# EAGLE design STM32F4DiscoveryBreakoutBoard (EAGLE 9.2.2)
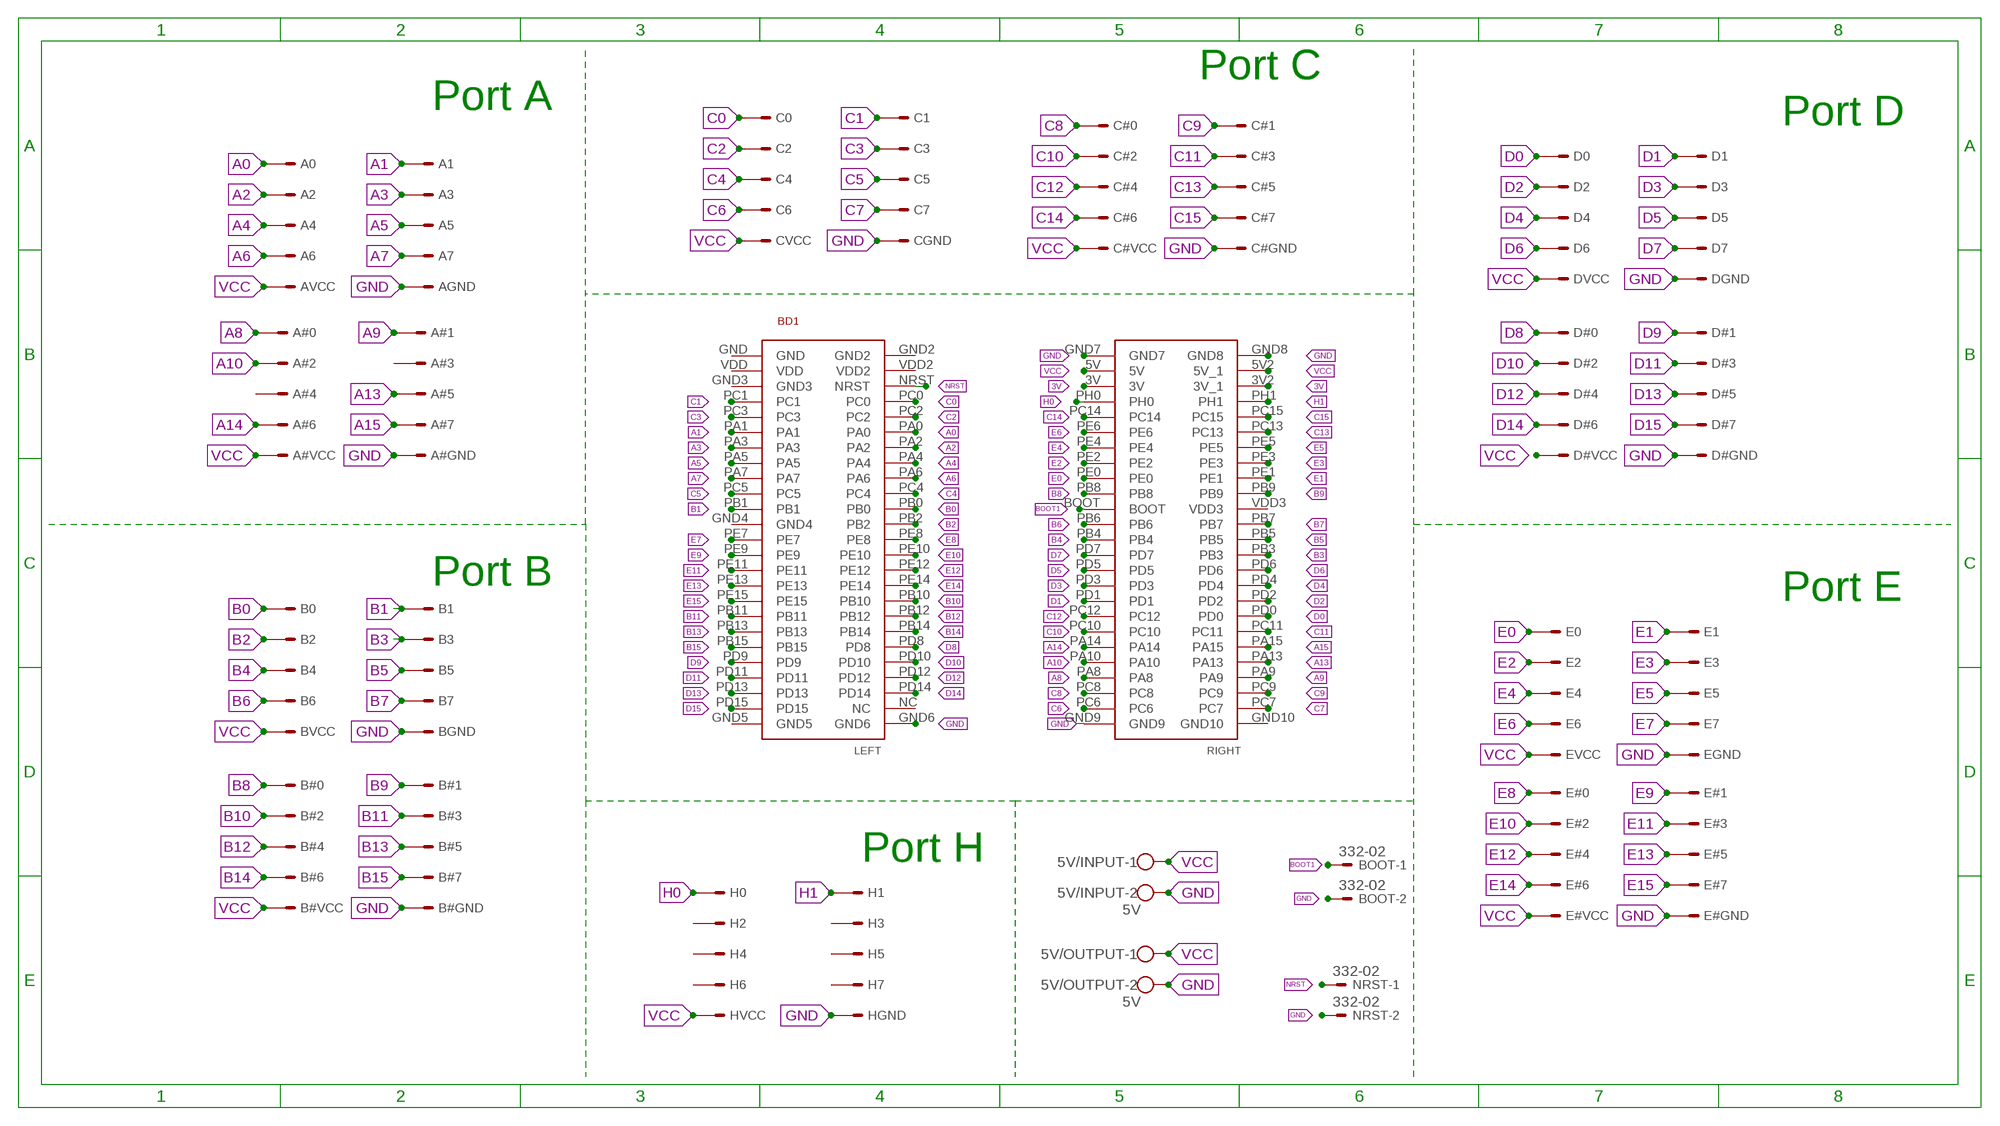
[diagram p0: schematic, sheet 1]

## Parts
5V/INPUT  5V  W237-102  [W237-102]
5V/OUTPUT  5V  W237-102  [W237-102]
A  FR1  [057-010-1]
A#  FR1  [057-010-1]
B  FR1  [057-010-1]
B#  FR1  [057-010-1]
BD1  STM32F4-DISCOVERY  [STM32F407VG]
BOOT  332-02  [332-02]
C  FR1  [057-010-1]
C#  FR1  [057-010-1]
D  FR1  [057-010-1]
D#  FR1  [057-010-1]
E  FR1  [057-010-1]
E#  FR1  [057-010-1]
H  FR1  [057-010-1]
NRST  332-02  [332-02]

## Nets
3V: BD1.3V BD1.3V2(3V_1)
A0: A.0 BD1.PA0
A1: A.1 BD1.PA1
A2: A.2 BD1.PA2
A3: A.3 BD1.PA3
A4: A.4 BD1.PA4
A5: A.5 BD1.PA5
A6: A.6 BD1.PA6
A7: A.7 BD1.PA7
A8: A#.0 BD1.PA8
A9: A#.1 BD1.PA9
A10: A#.2 BD1.PA10
A13: A#.5 BD1.PA13
A14: A#.6 BD1.PA14
A15: A#.7 BD1.PA15
B0: B.0 BD1.PB0
B1: B.1 BD1.PB1
B2: B.2 BD1.PB2
B3: B.3 BD1.PB3
B4: B.4 BD1.PB4
B5: B.5 BD1.PB5
B6: B.6 BD1.PB6
B7: B.7 BD1.PB7
B8: B#.0 BD1.PB8
B9: B#.1 BD1.PB9
B10: B#.2 BD1.PB10
B11: B#.3 BD1.PB11
B12: B#.4 BD1.PB12
B13: B#.5 BD1.PB13
B14: B#.6 BD1.PB14
B15: B#.7 BD1.PB15
BOOT1: BD1.BOOT BOOT.1
C0: BD1.PC0 C.0
C1: BD1.PC1 C.1
C2: BD1.PC2 C.2
C3: BD1.PC3 C.3
C4: BD1.PC4 C.4
C5: BD1.PC5 C.5
C6: BD1.PC6 C.6
C7: BD1.PC7 C.7
C8: BD1.PC8 C#.0
C9: BD1.PC9 C#.1
C10: BD1.PC10 C#.2
C11: BD1.PC11 C#.3
C12: BD1.PC12 C#.4
C13: BD1.PC13 C#.5
C14: BD1.PC14 C#.6
C15: BD1.PC15 C#.7
D0: BD1.PD0 D.0
D1: BD1.PD1 D.1
D2: BD1.PD2 D.2
D3: BD1.PD3 D.3
D4: BD1.PD4 D.4
D5: BD1.PD5 D.5
D6: BD1.PD6 D.6
D7: BD1.PD7 D.7
D8: BD1.PD8 D#.0
D9: BD1.PD9 D#.1
D10: BD1.PD10 D#.2
D11: BD1.PD11 D#.3
D12: BD1.PD12 D#.4
D13: BD1.PD13 D#.5
D14: BD1.PD14 D#.6
D15: BD1.PD15 D#.7
E0: BD1.PE0 E.0
E1: BD1.PE1 E.1
E2: BD1.PE2 E.2
E3: BD1.PE3 E.3
E4: BD1.PE4 E.4
E5: BD1.PE5 E.5
E6: BD1.PE6 E.6
E7: BD1.PE7 E.7
E8: BD1.PE8 E#.0
E9: BD1.PE9 E#.1
E10: BD1.PE10 E#.2
E11: BD1.PE11 E#.3
E12: BD1.PE12 E#.4
E13: BD1.PE13 E#.5
E14: BD1.PE14 E#.6
E15: BD1.PE15 E#.7
GND: 5V/INPUT.2 5V/OUTPUT.2 A#.GND A.GND B#.GND B.GND BD1.GND6 BD1.GND7 BD1.GND8 BD1.GND9 BOOT.2 C#.GND C.GND D#.GND D.GND E#.GND E.GND H.GND NRST.2
H0: BD1.PH0 H.0
H1: BD1.PH1 H.1
NRST: BD1.NRST NRST.1
VCC: 5V/INPUT.1 5V/OUTPUT.1 A#.VCC A.VCC B#.VCC B.VCC BD1.5V BD1.5V2(5V_1) C#.VCC C.VCC D#.VCC D.VCC E#.VCC E.VCC H.VCC
Unconnected: A#.3 A#.4 BD1.GND BD1.GND2 BD1.GND3 BD1.GND4 BD1.GND5 BD1.GND10 BD1.NC BD1.VDD BD1.VDD2 BD1.VDD3 H.2 H.3 H.4 H.5 H.6 H.7

## Notes on the sheet
- Port C
- Port A
- Port D
- Port B
- Port E
- Port H

## Library data of the parts
5V/INPUT 5V/OUTPUT = con-wago-500:W237-102: WAGO SCREW CLAMP; MPN: 237-102; OC_FARNELL: unknown; OC_NEWARK: 70K9898
A A# B B# C C# D D# E E# H = FRC (1):FR: CONNECTOR 10-pin series 057 contact pc board low profile headers; OC_FARNELL: unknown; OC_NEWARK: unknown
BD1 = STM32F4 DISCOVERY:STM32F4-DISCOVERY: STM32F4DISCOVERY STM32F407VG Create by Jairo Reyes Email: jairo.314@hotmail.com
BOOT NRST = con-garry:332-02: 2 Pin - 2mm Dual Row Source: www.mpe-connector.de / garry_shortform_2012.pdf

## Board
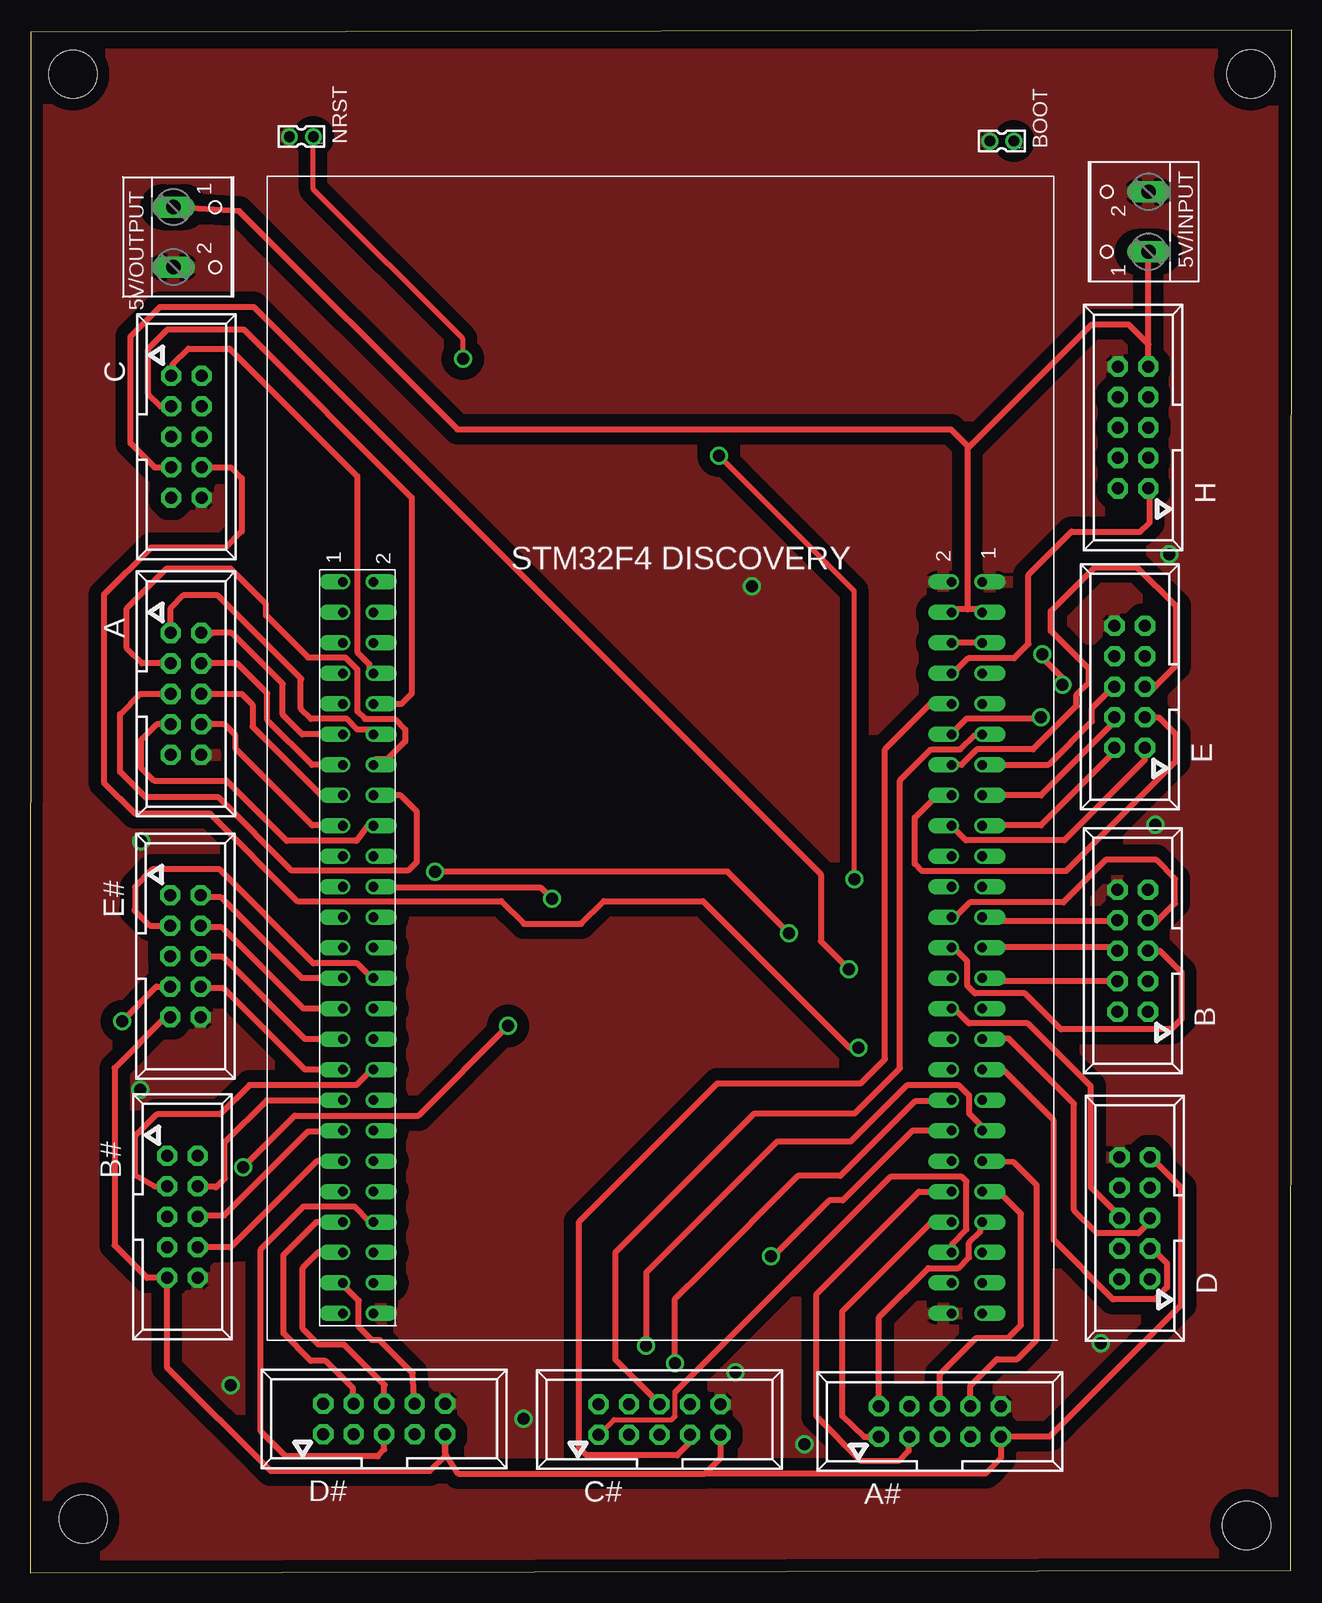
[diagram p1: board, top side]
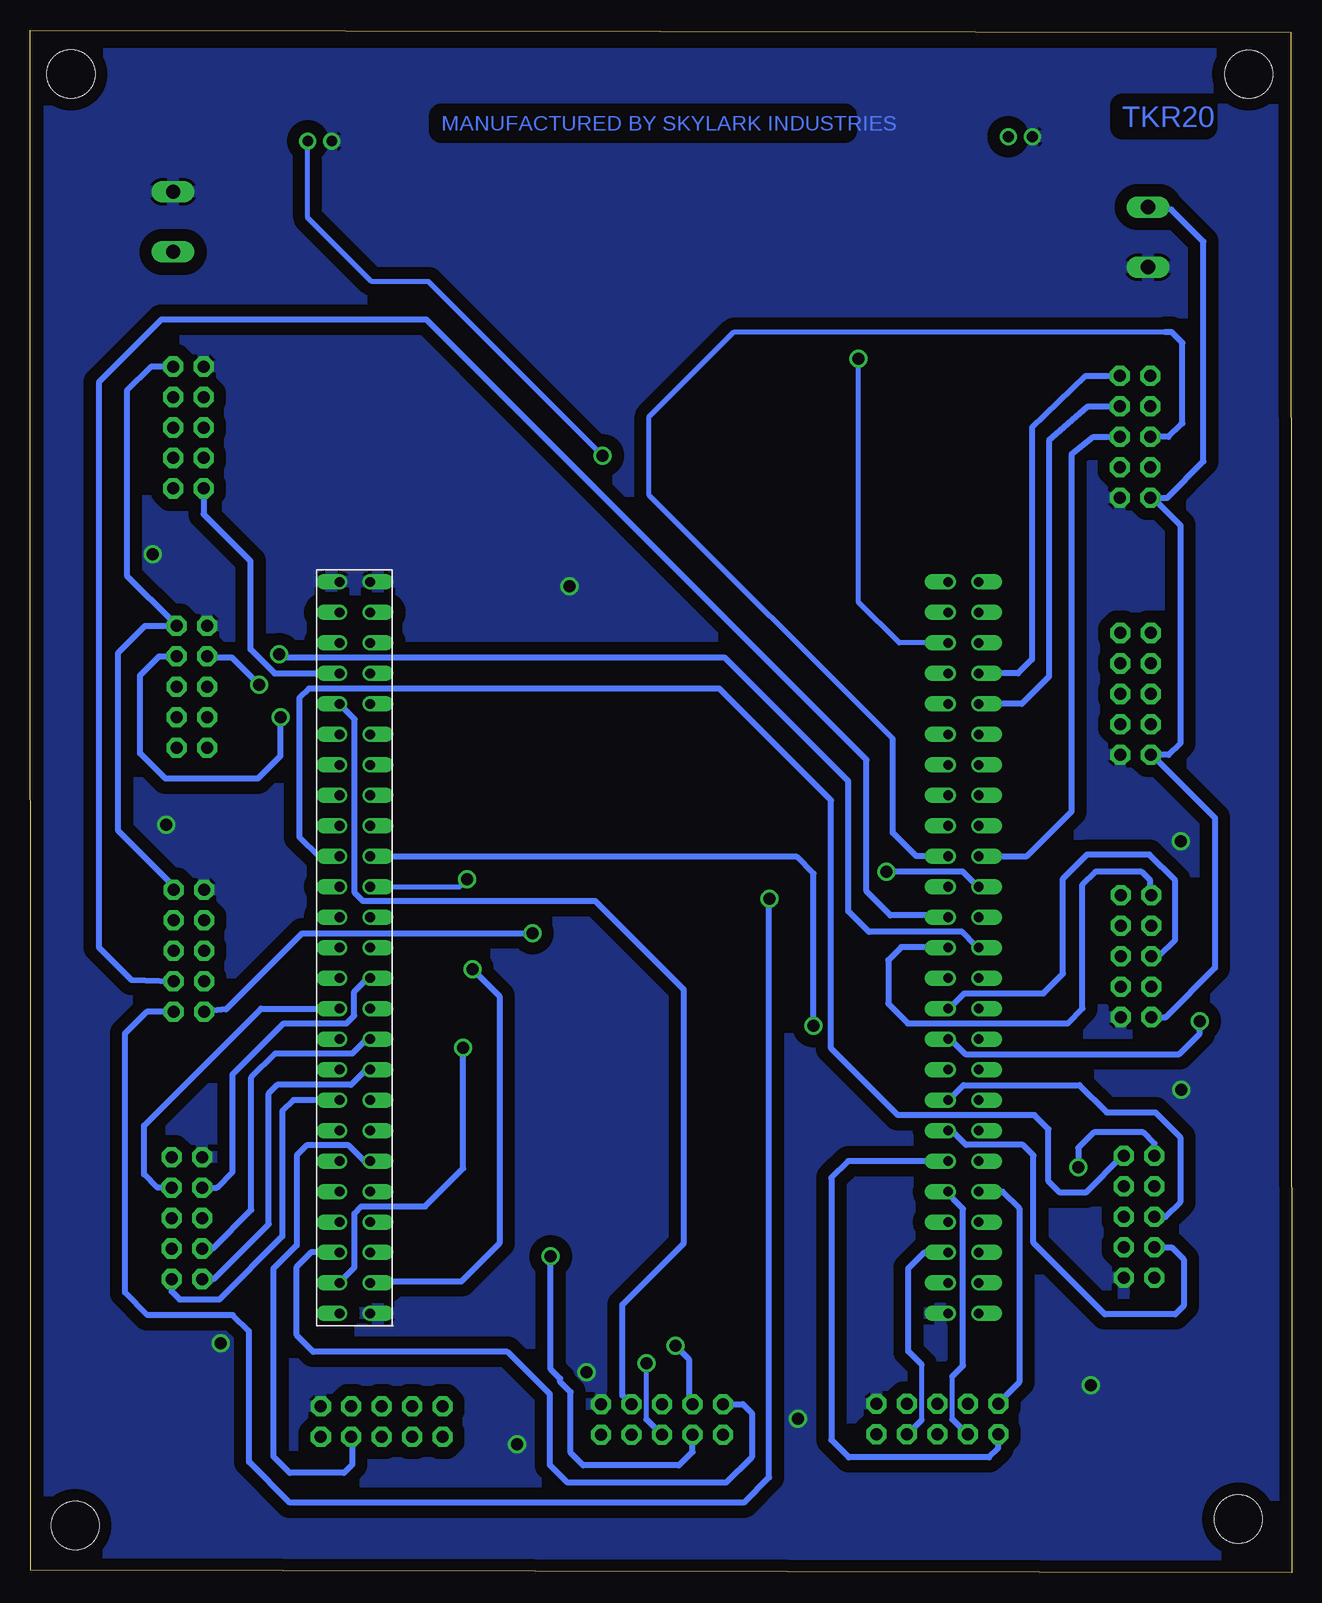
[diagram p2: board, bottom side, seen from below]

Size 105.18 x 128.56 mm. Coordinates in mm from the lower left corner, seen from the top.
Outline: 0,0 105.1,0.19 105.18,128.56 0.08,128.37 0,0
Copper layers (1*16): Top 0.035mm / dielectric 1.5mm / Bottom 0.035mm
Design rules "default *": minimum track width 0.4mm, minimum drill 1mm, track to track 6mil, track to pad 6mil, pad to pad 6mil, via to via 1mm, smd to smd 6mil, copper to edge 40mil, drill to drill 1mm, minimum pad ring 10mil, minimum via ring 8mil, stop-mask expansion 4mil, vias tented up to drill 0mil, thermal gap 10mil
Holes 4 mm at 3.58,124.87 4.44,4.47 101.76,124.9 101.41,3.94

### Footprints (pad centres in the part's own frame; a part is rotated, then mirrored left to right if it is on the bottom)
W237-102 = drill 1.194 long: 1 -2.5,-1.27; 2 2.5,-1.27
057-010-1 = drill 1 pad 1.676 octagon: 0 -5.08,-1.27; 1 -5.08,1.27; 2 -2.54,-1.27; 3 -2.54,1.27; 4 0,-1.27; 5 0,1.27; 6 2.54,-1.27; 7 2.54,1.27; GND 5.08,1.27; VCC 5.08,-1.27
STM32F407VG = drill 0.8 pad 1.27 offset: 3V 50.74,55.88; 3V2 53.28,55.88; 5V 50.74,58.42; 5V2 53.28,58.42; BOOT 50.74,35.56; GND 0,60.96; GND2 2.54,60.96; GND3 0,55.88; GND4 0,33.02; GND5 0,0; GND6 2.54,0; GND7 50.74,60.96; GND8 53.28,60.96; GND9 50.74,0; GND10 53.28,0; NC 2.54,2.54; NRST 2.54,55.88; PA0 2.54,48.26; PA1 0,48.26; PA2 2.54,45.72; PA3 0,45.72; PA4 2.54,43.18; PA5 0,43.18; PA6 2.54,40.64; PA7 0,40.64; PA8 50.74,7.62; PA9 53.28,7.62; PA10 50.74,10.16; PA13 53.28,10.16; PA14 50.74,12.7; PA15 53.28,12.7; PB0 2.54,35.56; PB1 0,35.56; PB2 2.54,33.02; PB3 53.28,27.94; PB4 50.74,30.48; PB5 53.28,30.48; PB6 50.74,33.02; PB7 53.28,33.02; PB8 50.74,38.1; PB9 53.28,38.1; PB10 2.54,20.32; PB11 0,17.78; PB12 2.54,17.78; PB13 0,15.24; PB14 2.54,15.24; PB15 0,12.7; PC0 2.54,53.34; PC1 0,53.34; PC2 2.54,50.8; PC3 0,50.8; PC4 2.54,38.1; PC5 0,38.1; PC6 50.74,2.54; PC7 53.28,2.54; PC8 50.74,5.08; PC9 53.28,5.08; PC10 50.74,15.24; PC11 53.28,15.24; PC12 50.74,17.78; PC13 53.28,48.26; PC14 50.74,50.8; PC15 53.28,50.8; PD0 53.28,17.78; PD1 50.74,20.32; PD2 53.28,20.32; PD3 50.74,22.86; PD4 53.28,22.86; PD5 50.74,25.4; PD6 53.28,25.4; PD7 50.74,27.94; PD8 2.54,12.7; PD9 0,10.16; PD10 2.54,10.16; PD11 0,7.62; PD12 2.54,7.62; PD13 0,5.08; PD14 2.54,5.08; PD15 0,2.54; PE0 50.74,40.64; PE1 53.28,40.64; PE2 50.74,43.18; PE3 53.28,43.18; PE4 50.74,45.72; PE5 53.28,45.72; PE6 50.74,48.26; PE7 0,30.48; PE8 2.54,30.48; PE9 0,27.94; PE10 2.54,27.94; PE11 0,25.4; PE12 2.54,25.4; PE13 0,22.86; PE14 2.54,22.86; PE15 0,20.32; PH0 50.74,53.34; PH1 53.28,53.34; VDD 0,58.42; VDD2 2.54,58.42; VDD3 53.28,35.56
332-02 = drill 0.9 pad 1.27: 1 0,-1; 2 0,1

### Placement (x,y rotation side)
5V/INPUT  91.97,112.58 90 top
5V/OUTPUT  13.23,111.31 270 top
A  13.01,73.23 270 top
A#  75.85,12.59 0 top
B  91.93,51.82 90 top
B#  12.71,29.65 270 top
BD1  26.08,21.61 0 top
BOOT  81.02,119.3 90 top
C  13.05,94.65 270 top
C#  52.48,12.77 0 top
D  92.1,29.55 90 top
D#  29.53,12.82 0 top
E  91.68,73.82 90 top
E#  12.96,51.38 270 top
H  91.97,95.43 90 top
NRST  22.62,119.67 90 top

### Tracks (layer width: path | path; a pad name or v marks a point on that pad's centre or on a via)
3V
  Top 0.5: BD1.3V 76.86,77.51 79.35,77.51 BD1.3V2
A0
  Top 0.5: BD1.PA0 28.28,70.29 27.28,70.29 26.42,71.15 23.42,71.15 22.57,72 22.57,74.43 22.62,74.48 15.66,81.44 12.78,81.44 11.74,80.39 A.0
A1
  Top 0.5: A.1 14.28,78.29 15.19,78.29 15.22,78.32 16.83,78.32 | BD1.PA1 22.7,69.87 21.08,71.49 21.08,74.07 16.83,78.32 | 16.83,78.32
A2
  Top 0.5: BD1.PA2 28.78,67.79 29.78,67.79 31.28,69.29 31.28,70.29 30.42,71.15 27.92,71.15 27.28,71.79 27.28,75.29 26.28,76.29 23.17,76.29 19.68,79.78 19.68,80.71 16.7,83.69 11.4,83.69 8.07,80.36 8.07,77.04 9.34,75.77 A.2
A3
  Top 0.5: BD1.PA3 23.51,67.33 19.79,71.05 19.79,73.27 17.29,75.77 A.3
A4
  Top 0.5: BD1.PA4 28.62,64.77 30.89,64.77 32.25,63.41 32.25,59.25 31.51,58.51 21.83,58.51 15.74,64.6 9.66,64.6 7.52,66.74 7.52,71.55 9.19,73.23 A.4
A5
  Top 0.5: A.5 17.67,73.23 18.55,72.35 18.55,70.5 24.26,64.79 BD1.PA5
A6
  Top 0.5: BD1.PA6 28.14,62.25 27.22,61 21.41,61 16.39,66.01 10.33,66.01 9.25,67.09 9.25,69.38 10.55,70.69 A.6
A7
  Top 0.5: BD1.PA7 26.04,62.29 23.53,62.29 17.14,68.68 17.14,69.79 16.24,70.69 A.7
A8
  Top 0.5: BD1.PA8 76.81,29.24 75.18,29.24 67.72,21.78 67.72,13.08 69.55,11.32 A#.0
A9
  Top 0.5: BD1.PA9 79.21,28.41 78.28,27.48 78.28,26.29 77.38,25.39 74.88,25.39 70.78,21.29 70.78,14.29 A#.1
A10
  Top 0.5: BD1.PA10 74.11,31.77 65.56,23.22 65.56,13.03 69.28,9.31 72.42,9.31 73.25,10.14 73.25,11.26 A#.2
A13
  Top 0.5: BD1.PA13 80.76,31.77 82.62,29.91 82.62,20.63 81.56,19.57 78.9,19.57 75.85,16.52 A#.5
A14
  Bottom 0.5: A#.6 78.32,11.25 78.32,9.01 79,8.32 83.52,8.32 84.87,9.67 84.87,25.36 82.94,27.28 82.94,34.78 82.12,35.6 78.6,35.6 77.28,34.29 BD1.PA14
A15
  Top 0.5: BD1.PA15 82.03,34.19 83.92,32.31 83.92,19.43 82.29,17.8 80.62,17.8 78.36,15.54 78.39,15.51 A#.7
B0  (via drill 1)
  Top 0.5: v43.52,56.17 42.62,57.07 28.66,57.07 BD1.PB0
  Bottom 0.5: v43.52,56.17 43.56,56.13 43.56,7.94 45.66,5.84 83.53,5.84 86.92,9.24 86.92,20.12 88.27,21.47 95.38,21.47 97.25,23.34 97.25,44.94 95.44,46.75 B.0
B1  (via drill 1)
  Top 0.5: v33.76,58.42 58.15,58.42 v63.28,53.29
  Bottom 0.5: v33.76,58.42 v33.76,58.44 27.43,58.44 26.28,57.29 BD1.PB1 | v63.28,53.29 82.48,53.29 88.82,46.95 B.1
B2
  Bottom 0.5: BD1.PB2 28.78,54.79 33.46,54.79 35.45,56.77 35.45,67.74 72.12,104.42 94.22,104.42 99.44,99.2 99.44,52.1 96.73,49.4 B.2
B3
  Top 0.5: BD1.PB3 79.78,49.29 90.28,49.29 B.3
B4
  Top 0.5: BD1.PB4 77.02,52.09 78.14,50.97 78.14,48.93 78.78,48.29 82.95,48.29 85.95,45.29 95.15,45.29 95.99,46.12 95.99,50.05 94.21,51.83 B.4
B5
  Top 0.5: BD1.PB5 79.44,52.12 90.42,52.12 B.5
B6
  Top 0.5: B.6 94.04,54.37 95.45,55.78 95.45,57.82 93.88,59.39 89.68,59.39 86.15,55.87 78.36,55.87 77.28,54.79 BD1.PB6
B7
  Top 0.5: B.7 90.58,54.28 79.7,54.28 BD1.PB7
B8  (via drill 1)
  Top 0.5: v39.85,45.56 32.38,38.09 22.08,38.09 v17.78,33.79
  Bottom 0.5: v39.85,45.56 39.85,58.25 41.26,59.66 76.78,59.66 76.78,59.67 BD1.PB8 | v17.78,33.79 17.78,35.39 16.49,36.69 12.38,36.69 11.44,35.75 B#.0
B9
  Bottom 0.5: B#.1 14.1,34.73 17.17,31.66 19.31,31.66 20.26,32.62 20.26,36.97 21.43,38.14 32.82,38.14 38.39,43.7 38.39,64.36 47.7,73.68 81.94,73.68 82.72,72.9 82.72,61.3 81.13,59.71 BD1.PB9
B10
  Top 0.5: BD1.PB10 28.4,41.84 27.2,40.63 18.31,40.63 15.87,38.2 10.57,38.2 8.74,36.37 8.74,33.15 10.42,32.19 B#.2
B11
  Top 0.5: B#.3 15.44,32.19 15.52,32.11 16.24,32.83 16.24,35.85 19.77,39.39 BD1.PB11
B12
  Bottom 0.5: BD1.PB12 28.28,39.79 28.21,39.79 27.36,40.64 17.68,40.64 15.41,38.36 11.36,38.36 9.29,36.29 9.29,30.89 10.52,29.65 B#.4
B13
  Top 0.5: BD1.PB13 25.78,36.79 23.2,36.79 16.2,29.79 14.28,29.79 B#.5
B14
  Bottom 0.5: B#.6 10,27.11 9,26.11 9,22.24 9.72,21.52 15.56,21.52 21.53,27.49 21.53,34.79 22.4,35.65 27.15,35.65 28.28,36.79 BD1.PB14
B15
  Top 0.5: BD1.PB15 25.78,34.29 23.89,34.29 16.72,27.11 B#.7
BOOT1  (via drill 1)
  Top 0.4: v68.72,57.77 68.72,81.8 v57.43,93.09
  Bottom 0.4: BD1.BOOT 69.33,57.17 v68.72,57.77 | v57.43,93.09 71.93,107.59 76.7,107.59 82.02,112.91 BOOT.1
C0
  Top 0.5: BD1.PC0 28.28,75.29 28.28,75.72 27.28,76.72 27.28,91.38 16.64,102.01 13.21,102.01 11.89,100.69 C.0
C1
  Bottom 0.5: BD1.PC1 22.82,74.95 21.65,76.11 21.65,95.43 17.17,99.73 C.1
C2
  Top 0.5: BD1.PC2 28.64,72.38 30.94,72.38 31.82,73.27 31.82,89.6 17.81,103.61 11.47,103.61 9.87,102 9.87,98.22 10.89,97.19 C.2
C3
  Bottom 0.5: BD1.PC3 22.5,72.41 20.23,74.67 20.23,94.36 16.98,97.19 C.3
C4
  Bottom 0.4: 33.25,69.48 53.56,89.79 53.56,96.33 46.48,103.41 10.55,103.41
  Bottom 0.5: 33.25,69.48 33.25,61.66 31.29,59.71 BD1.PC4 | C.4 10.28,94.65 9.21,95.72 9.1,95.75 9.1,102.5 10.02,103.41 10.55,103.41
C5
  Bottom 0.5: BD1.PC5 22.07,59.71 18.36,63.41 18.36,93.2 16.51,94.65 C.5
C6  (via drill 1)
  Top 0.5: v68.28,50.29 65.94,52.63 65.94,58.22 18.66,105.5 10.85,105.5 8.38,103.02 8.38,94.11 10.38,92.11 C.6
  Bottom 0.5: BD1.PC6 76.78,24.29 69.21,24.29 66.04,27.45 66.04,48.05 v68.28,50.29
C7  (via drill 1)
  Top 0.5: C.7 16.76,92.11 17.65,91.22 17.65,86.77 16.3,85.42 10.09,85.42 6.16,81.49 6.16,65.85 8.73,63.27 14.98,63.27 22.28,55.97 39.28,55.97 41.18,54.07 45.94,54.07 47.84,55.97 56.09,55.97 68.3,43.75 v69.05,43.75
  Bottom 0.5: v69.05,43.75 69.05,33.69 72.23,30.52 77.57,30.52 78.15,29.93 78.15,25.42 79.28,24.29 BD1.PC7
C8
  Top 0.4: 53.78,15.05 53.78,13.04 53.51,12.77 48.67,12.77 C#.0
  Top 0.5: 53.78,15.05 71.72,32.99 77.69,32.99 78.07,32.61 78.07,28.58 76.88,27.39 76.88,26.7 BD1.PC8
C9
  Bottom 0.5: C#.1 45.75,14.04 45,13.29 45,9.64 47.14,7.5 60.36,7.5 61.83,8.97 61.83,14.87 65.37,18.41 81.56,18.41 82.94,19.79 82.94,25.49 81.74,26.69 BD1.PC9
C10  (via drill 1)
  Top 0.5: v61.77,26.36 61.77,26.15 66.63,31.02 67.76,31.02 73.58,36.85 BD1.PC10
  Bottom 0.5: v61.77,26.36 | C#.2 49.94,10.08 51.08,8.94 59.06,8.94 60.11,10 60.11,15.04 60.98,15.91 60.98,16.17 61.77,16.96 v61.77,26.36
C11  (via drill 1)
  Top 0.5: 51.36,19.28 v51.36,18.91 51.36,25 62.28,35.92 68.4,35.92 73.1,40.62 77.45,40.62 78.28,39.79 78.28,38.29 79.28,37.29 BD1.PC11
  Bottom 0.5: v51.36,18.91 50.24,17.8 50.24,14.26 C#.3
C12  (via drill 1)
  Top 0.5: v53.79,17.44 53.79,22.83 56.13,25.17 64.02,33.06 67.55,33.06 73.78,39.29 76.78,39.29 BD1.PC12
  Bottom 0.4: 53.78,12.79 v53.78,17.43
  Bottom 0.5: v53.78,17.43 v53.79,17.44 | 53.78,12.79 52.78,11.79 C#.4
C13
  Top 0.5: BD1.PC13 79.28,69.79 78.71,69.79 77.54,68.61 75.11,68.61 72.53,66.03 72.53,42.04 68.77,38.28 60.41,38.28 48.78,26.65 48.78,17.79 52.28,14.29 C#.5
C14
  Top 0.5: C#.6 55.02,10.86 53.96,9.79 46.4,9.79 45.78,10.41 45.78,29.24 57.3,40.77 69.26,40.77 71.28,42.79 71.28,68.61 75.04,72.37 76.81,72.37 BD1.PC14
C15
  Bottom 0.5: BD1.PC15 79.28,72.29 78.1,71.11 78.1,56.65 77.42,55.97 58.03,55.97 50.67,48.6 50.67,27.46 55.78,22.35 55.78,14.79 55.28,14.29 C#.7
D0
  Bottom 0.5: D.0 93.37,23.45 92.71,22.79 89.38,22.79 84.14,28.03 84.14,38.48 83.23,39.39 BD1.PD0
D1
  Bottom 0.5: BD1.PD1 77.28,41.79 78.42,40.65 84.57,40.65 85.28,39.94 85.28,29.05 89.87,24.46 90.82,24.46 D.1
D2
  Top 0.5: BD1.PD2 80.88,41.93 81.22,41.81 85.33,37.7 85.33,27.73 90.28,22.79 93.78,22.79 94.78,23.79 94.78,25.79 93.78,26.79 D.2
D3
  Bottom 0.5: BD1.PD3 77.28,44.29 78.28,43.29 84.7,43.29 86.72,41.27 86.72,30.23 89.94,27.02 D.3
D4
  Top 0.5: BD1.PD4 79.32,44.47 79.28,44.5 81.6,44.5 87.04,39.06 87.04,30.21 88.96,28.29 92.39,28.29 93.23,29.12 D.4
D5
  Top 0.5: BD1.PD5 77.28,46.79 78.28,45.79 83.19,45.79 88.43,40.54 88.43,32.14 90.78,29.79 D.5
D6
  Bottom 0.5: D.6 94.56,32.1 95.66,33.2 95.66,37.26 85.91,47.01 BD1.PD6
D7
  Bottom 0.5: D.7 89.59,32.1 88.28,33.41 88.28,41.54 84.03,45.79 78.78,45.79 78.15,46.42 78.15,48.42 77.28,49.29 BD1.PD7
D8
  Bottom 0.5: BD1.PD8 36.97,34.31 38.37,32.9 38.37,11.07 36.91,9.61 25.22,9.61 24.45,10.38 D#.0
D9
  Bottom 0.5: D#.1 24.28,14.29 22.7,15.87 22.7,30.36 24.11,31.77 BD1.PD9
D10
  Bottom 0.4: 28.28,12.79 28.28,16.36
  Bottom 0.5: 28.28,16.36 27.39,17.26 27.39,30.32 28.09,31.02 BD1.PD10 | 28.28,12.79 27.28,11.79 D#.2
D11
  Top 0.5: BD1.PD11 23.87,29.23 21.13,26.49 21.13,19.94 23.41,17.66 24.64,17.66 26.92,15.39 26.92,14.17 D#.3
D12
  Top 0.5: BD1.PD12 28.28,29.29 27.04,30.52 22.81,30.52 19.24,26.95 19.24,11.79 21.33,9.7 28.98,9.7 29.53,10.28 D#.4
D13
  Top 0.5: BD1.PD13 24.01,26.69 22.73,25.41 22.73,20.34 24.06,19.01 26.19,19.01 29.56,15.64 29.53,15.61 D#.5
D14
  Bottom 0.4: 30.82,12.75 30.82,17.32
  Bottom 0.5: BD1.PD14 30.61,26.7 31.95,25.36 31.95,18.45 30.82,17.32 | 30.82,12.75 31.78,11.79 D#.6
D15
  Top 0.5: BD1.PD15 26.28,23.79 27.4,22.67 27.4,20.51 28.52,19.39 29.15,19.39 31.91,16.63 D#.7
E0
  Top 0.5: BD1.PE0 78.04,61.03 86.22,61.03 92.95,67.77 E.0
E1
  Top 0.5: BD1.PE1 79.78,62.29 84.28,62.29 90.28,68.29 E.1
E2
  Top 0.5: BD1.PE2 76.81,64.67 75.5,64.67 73.76,62.93 73.76,59.06 74.36,58.47 86.36,58.47 95.47,67.58 95.47,69.91 94.1,71.29 E.2
E3
  Top 0.5: BD1.PE3 79.78,64.79 84.28,64.79 90.28,70.79 E.3
E4
  Top 0.5: E.4 93.79,73.83 95.53,75.56 95.53,80.57 92.29,83.81 88.77,83.81 85.1,80.14 85.1,78.48 88.26,75.32 88.26,74.17 87.24,73.15 87.24,72.24 83.62,68.62 78.95,68.62 77.66,67.33 BD1.PE4
E5
  Top 0.5: BD1.PE5 84.94,67.34 88.54,70.94 88.54,72.05 90.28,73.79 E.5
E6  (via drill 1)
  Top 0.5: BD1.PE6 76.82,69.92 78.08,71.17 84.17,71.17 v84.28,71.29
  Bottom 0.5: v84.28,71.29 84.28,68.08 86.2,66.16 93.88,66.16 96,68.28 96,74.78 94.41,76.37 E.6
E7  (via drill 1)
  Top 0.5: v86.06,74 86.64,74 84.39,76.24 v84.39,76.54
  Bottom 0.5: v84.39,76.54 84.15,76.29 47.29,76.29 36.95,65.96 36.95,55.12 35.24,53.4 27.46,53.4 26.35,52.29 26.28,52.29 BD1.PE7 | v86.06,74 88.34,76.29 90.28,76.29 E.7
E8
  Bottom 0.5: BD1.PE8 28.66,52.12 32.54,52.12 33.62,51.04 33.62,47.42 31.99,45.79 18.67,45.79 17.43,47.03 17.43,57.36 16.38,58.41 12.5,58.41 11.78,57.69 11.78,56.79 E#.0
E9
  Top 0.5: E#.1 14.28,56.29 15.93,56.29 22.67,49.55 BD1.PE9
E10
  Top 0.5: BD1.PE10 28.28,49.79 27.28,50.79 23.62,50.79 15.8,58.61 10.2,58.61 8.75,57.16 8.75,55.26 8.7,55.21 9.99,53.92 E#.2
E11
  Top 0.5: E#.3 14.28,53.79 16.02,53.79 22.8,47.01 BD1.PE11
E12
  Bottom 0.5: BD1.PE12 28.28,47.29 27.28,48.29 20.69,48.29 19.06,49.92 19.06,57.85 17.06,59.84 11.85,59.84 9.7,57.69 9.7,52.72 11.05,51.38 E#.4
E13
  Top 0.5: E#.5 14.28,51.29 14.31,51.32 16.09,51.32 22.95,44.47 BD1.PE13
E14  (via drill 1)
  Top 0.5: v7.67,45.95 v7.67,45.96 10.56,48.85 10.56,48.84 E#.6
  Bottom 0.5: v7.67,45.95 7.67,44.92 9.37,43.21 27.21,43.21 28.28,44.29 BD1.PE14
E15
  Top 0.5: E#.7 14.28,48.79 14.34,48.73 16.14,48.73 22.94,41.93 BD1.PE15
GND  (via drill 1)
  other vias: 16.73,15.62 94.96,84.88 9.18,40.23 58.79,16.72 89.28,19.1 93.81,62.34 41.14,12.82 9.25,60.94 64.56,10.72 60.2,82.21
  pour Bottom (isolate 1.016): 1.34,126.55 103.58,126.55 103.58,1.45 1.34,1.45
  pour Top (isolate 1.016): 1.34,126.55 103.58,126.55 103.58,1.45 1.34,1.45
H0
  Top 0.5: H.0 93.3,90.29 93.3,87.47 92.58,86.75 86.82,86.75 83.24,83.16 83.24,77.4 82.03,76.2 78.19,76.2 77.28,75.29 BD1.PH0
H1
  Bottom 0.5: BD1.PH1 84.78,74.94 86.78,76.94 86.78,84.29 90.7,88.21 H.1
NRST  (via drill 1)
  Top 0.4: v36.1,101.17 36.1,102.83 23.62,115.3 NRST.1
  Bottom 0.4: BD1.NRST 32.71,77.49 36.1,80.87 v36.1,101.17
VCC
  Top 0.5: C#.VCC 57.56,9.55 56.32,8.31 | 56.32,8.31 56.26,8.25 35.69,8.25 34.61,9.96 D#.VCC 34.61,9.76 33.33,8.48 20.07,8.48 11.41,17.13 11.41,24.54 B#.VCC 9.75,24.57 7.04,27.29 7.04,42.05 11.28,46.29 E#.VCC | 56.32,8.31 79.72,8.31 80.93,9.52 A#.VCC 80.97,11.37 85.02,11.37 95.99,22.34 95.99,32.08 93.78,34.29 D.VCC | 78.16,80.29 79.28,80.29 BD1.5V2 | 78.16,80.29 77.28,80.29 BD1.5V | 78.16,93.91 78.16,80.29 | 5V/INPUT.1 92.78,109.79 93.06,110.07 93.24,109.89 93.24,102.36 | H.VCC 93.24,102.36 | 5V/OUTPUT.1 17.45,113.46 35.63,95.29 76.78,95.29 78.16,93.91 | 78.16,93.91 78.28,93.79 88.52,104.03 91.57,104.03 93.24,102.36
  Bottom 0.5: H.VCC 95.06,100.51 97.09,98.48 97.09,83.1 93.28,79.29 E.VCC 95.58,78.91 97.82,76.66 97.82,61.83 93.28,57.29 B.VCC | 5V/OUTPUT.1 10.03,113.59 7.36,110.92 7.36,92.6 10.38,89.57 C.VCC 11.28,89.29 9.28,87.29 9.28,69.13 10.26,68.15 A.VCC 11.28,67.79 6.39,62.9 6.39,50.39 10.48,46.3 E#.VCC

### Text on the board
Bottom: TKR20 | MANUFACTURED BY SKYLARK INDUSTRIES